# EAGLE design 216_matrix (EAGLE 9.6.2)
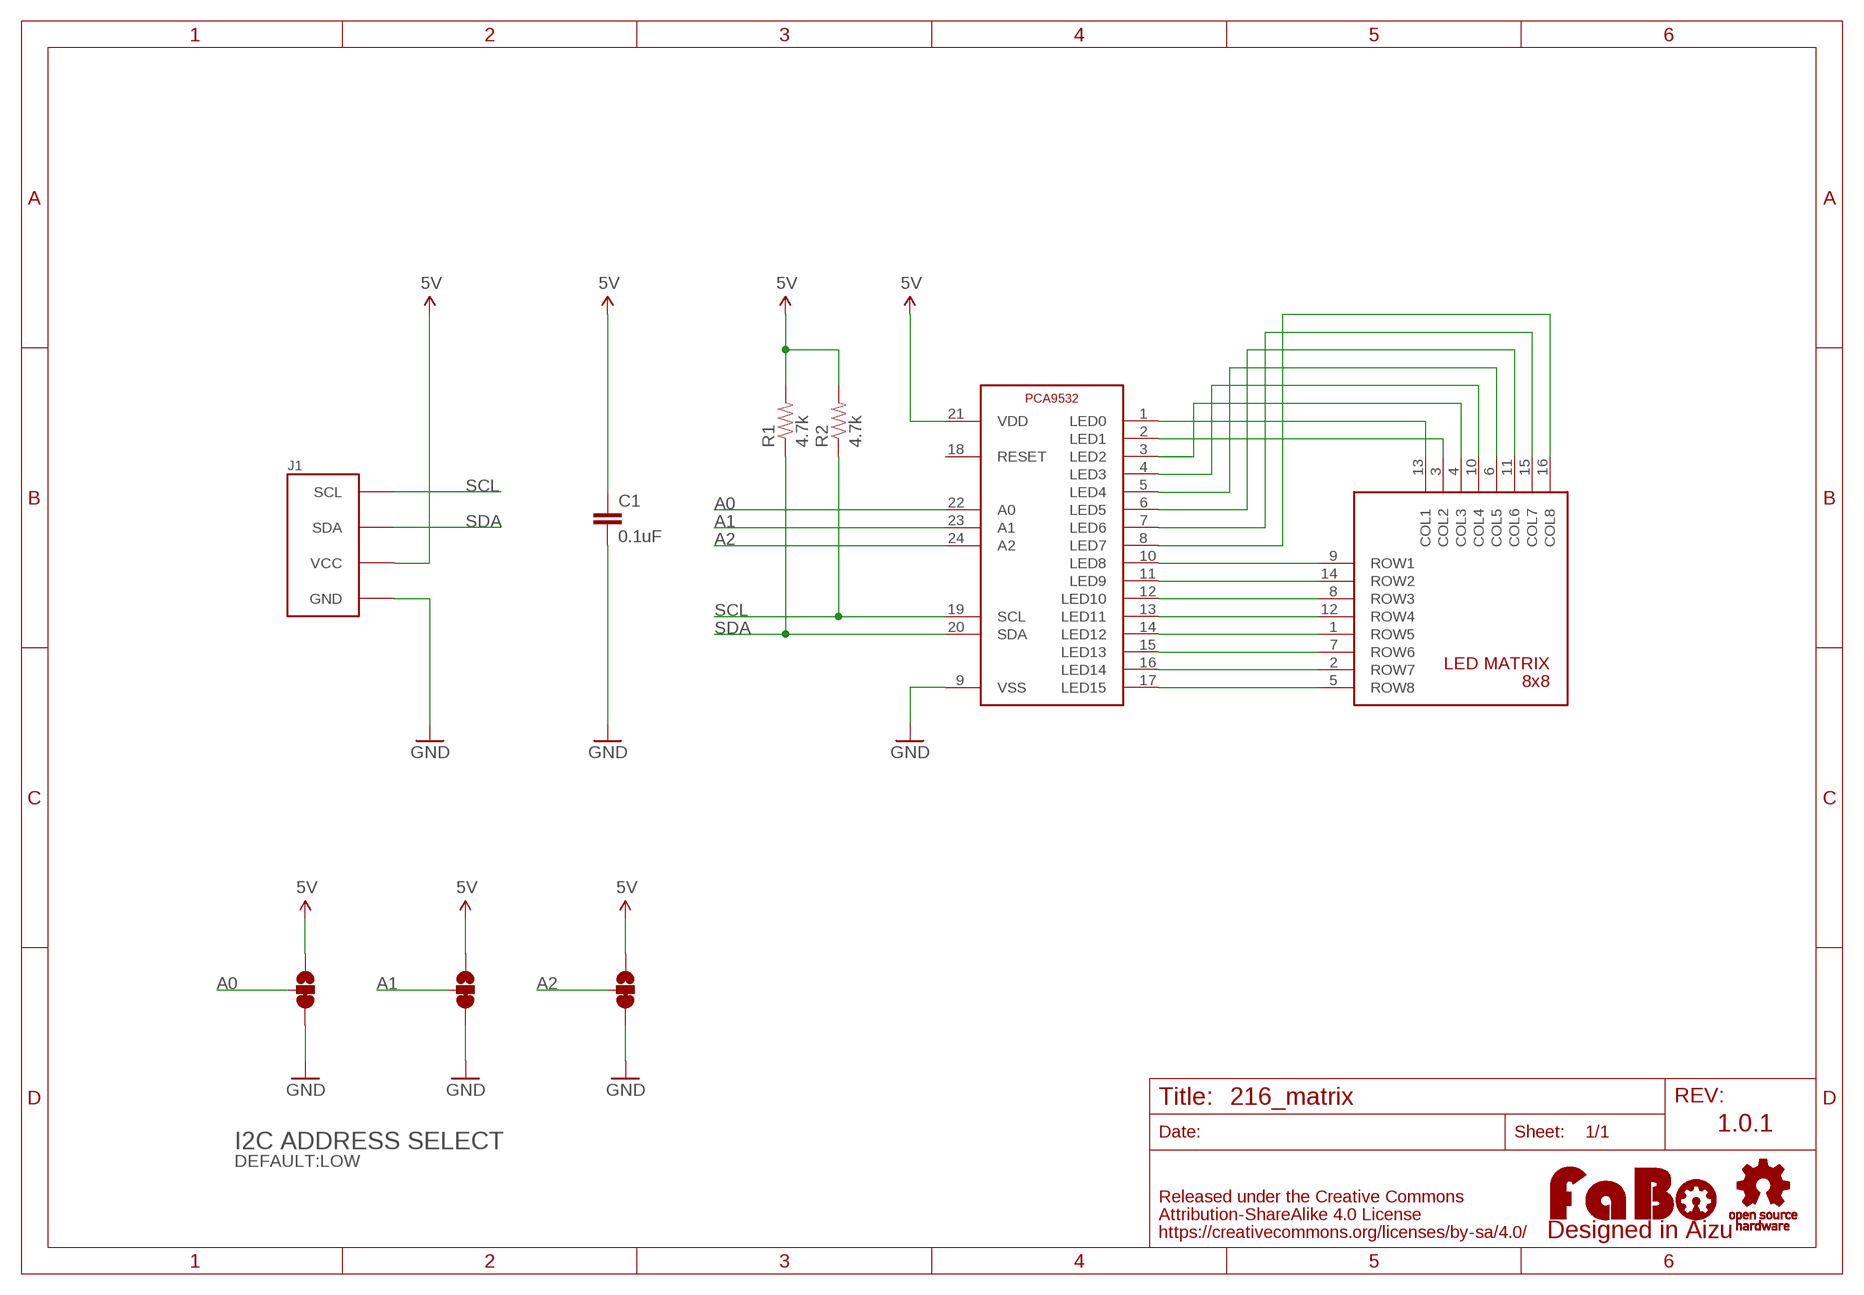
[diagram p0: schematic, sheet 1]

## Parts
A0  JUMPER-3_SMD  [JUMPER-SMD-3]
A1  JUMPER-3_SMD  [JUMPER-SMD-3]
A2  JUMPER-3_SMD  [JUMPER-SMD-3]
C1  0.1uF  CAP-EIA0603  [EIA0603]
IC1  PCA9532BS  [HVQFN24]
J1  FABO_BRICK_I2C  [FABO_BRICK_I2C]
LOGO1  LOGO_FABO-S  [LOGO_FABO_S]
R1  4.7k  RES-EIA0603  [EIA0603]
R2  4.7k  RES-EIA0603  [EIA0603]
U1  MATRIX_8X8_A_COM  [GYXM-788ASR]
U$2  LOGO_OSHW-M_BOTTOM  [LOGO_OSHW_M_BOTTOM]

## Nets
5V: A0.1 A1.1 A2.1 C1.1 IC1.21(VDD) J1.VCC R1.2 R2.2
A0: A0.2 IC1.22(A0)
A1: A1.2 IC1.23(A1)
A2: A2.2 IC1.24(A2)
GND: A0.3 A1.3 A2.3 C1.2 IC1.9(VSS) J1.GND
N$8: IC1.1(LED0) U1.13(COL1)
N$9: IC1.2(LED1) U1.3(COL2)
N$10: IC1.3(LED2) U1.4(COL3)
N$11: IC1.4(LED3) U1.10(COL4)
N$12: IC1.5(LED4) U1.6(COL5)
N$13: IC1.6(LED5) U1.11(COL6)
N$14: IC1.7(LED6) U1.15(COL7)
N$15: IC1.8(LED7) U1.16(COL8)
N$16: IC1.10(LED8) U1.9(ROW1)
N$17: IC1.11(LED9) U1.14(ROW2)
N$18: IC1.12(LED10) U1.8(ROW3)
N$19: IC1.13(LED11) U1.12(ROW4)
N$20: IC1.14(LED12) U1.1(ROW5)
N$21: IC1.15(LED13) U1.7(ROW6)
N$22: IC1.16(LED14) U1.2(ROW7)
N$23: IC1.17(LED15) U1.5(ROW8)
SCL: IC1.19(SCL) J1.SCL R2.1
SDA: IC1.20(SDA) J1.SDA R1.1
Unconnected: IC1.18(RESET)

## Notes on the sheet
- 1.0.1
- I2C ADDRESS SELECT
- DEFAULT:LOW

## Library data of the parts
A0 A1 A2 = component:JUMPER-3
C1 = FaBo-etc:CAP: Capacitor Standard 0603 ceramic capacitor
IC1 = FaBo-etc:PCA9532
J1 = FaBo-Template:FABO_BRICK_I2C: FaBo Brick I2C
LOGO1 = component:LOGO_FABO
R1 R2 = FaBo-etc:RES
U1 = FaBo-LED:MATRIX_8X8_A_COM
U$2 = component:LOGO_OSHW

## Board
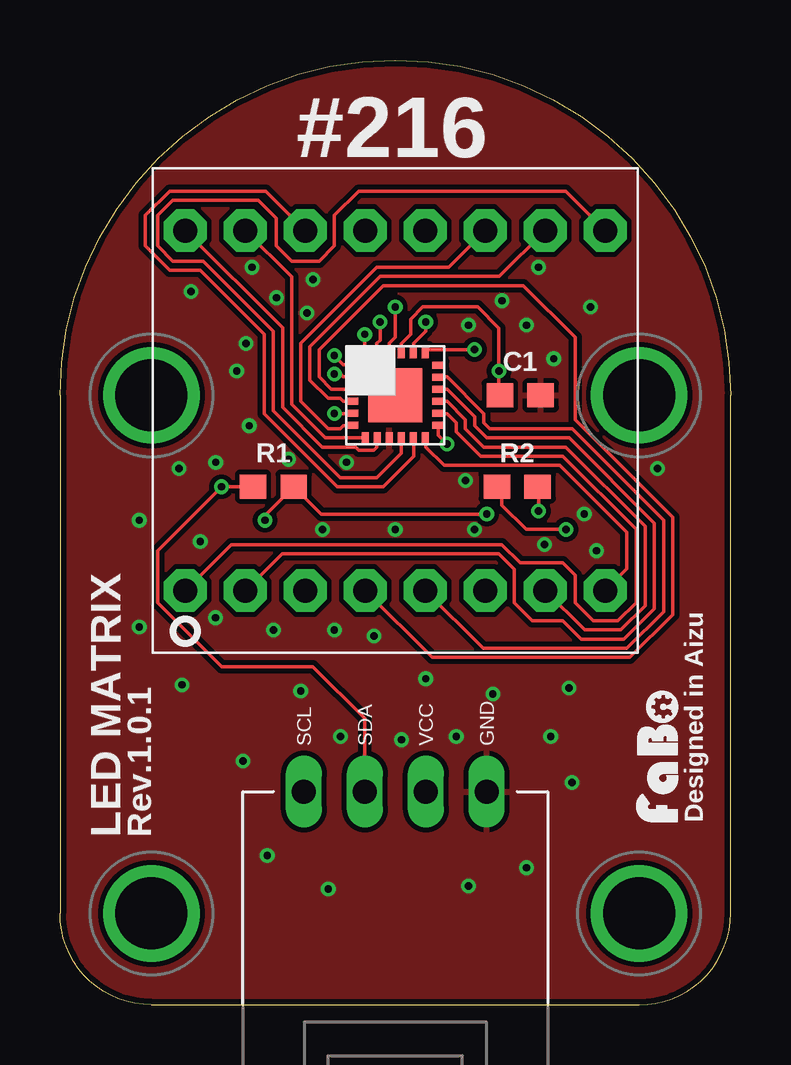
[diagram p1: board, top side]
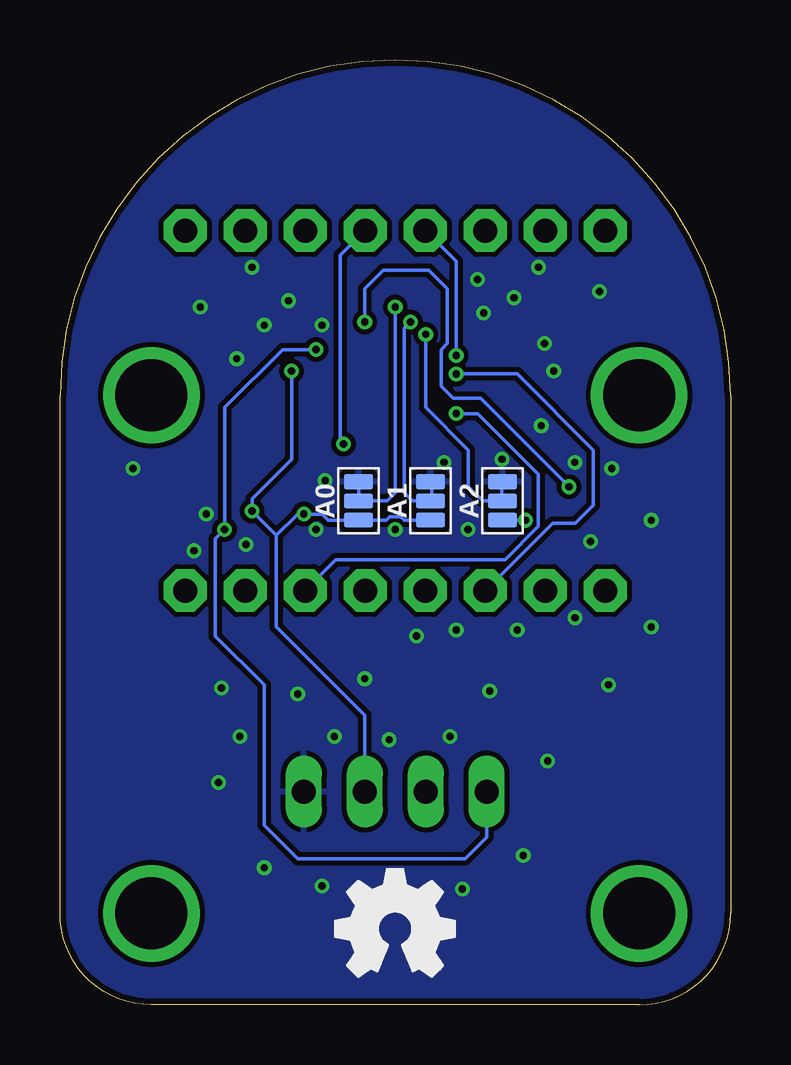
[diagram p2: board, bottom side, seen from below]

Size 27.94 x 39.37 mm. Coordinates in mm from the lower left corner, seen from the top.
Copper layers (1*16): Top 0.035mm / dielectric 1.6mm / Bottom 0.035mm
Design rules "PCBway": minimum track width 6mil, minimum drill 12mil, track to track 6mil, track to pad 6mil, pad to pad 6mil, via to via 6mil, smd to smd 6mil, copper to edge 10mil, drill to drill 10mil, minimum pad ring 10mil, minimum via ring 6mil, stop-mask expansion 2mil, vias tented up to drill 100mil, thermal gap 8mil

### Footprints (pad centres in the part's own frame; a part is rotated, then mirrored left to right if it is on the bottom)
JUMPER-SMD-3 = smd 0.64 x 1.2: 1 -0.8,0; 2 0,0; 3 0.8,0
EIA0603 = smd 1.1 x 1: 1 -0.85,0; 2 0.85,0
HVQFN24 = smd 0.5 x 0.3: 1 -1.8,1.25; 2 -1.8,0.75; 3 -1.8,0.25; 4 -1.8,-0.25; 5 -1.8,-0.75; 6 -1.8,-1.25; 13 1.8,-1.25; 14 1.8,-0.75; 15 1.8,-0.25; 16 1.8,0.25; 17 1.8,0.75; 18 1.8,1.25 | smd 0.3 x 0.5: 7 -1.25,-1.8; 8 -0.75,-1.8; 9 -0.25,-1.8; 10 0.25,-1.8; 11 0.75,-1.8; 12 1.25,-1.8; 19 1.25,1.8; 20 0.75,1.8; 21 0.25,1.8; 22 -0.25,1.8; 23 -0.75,1.8; 24 -1.25,1.8 | smd 2.25 x 2.25: 25 0,0
FABO_BRICK_I2C = drill 1 long: GND 3.81,-10.16; SCL -3.81,-10.16; SDA -1.27,-10.16; VCC 1.27,-10.16 | drill 3 pad 3.81: P$1 -10.16,6.35; P$2 10.16,6.35; P$3 -10.16,-15.24; P$4 10.16,-15.24
GYXM-788ASR = drill 1 pad 1.778 octagon: 1 -8.75,-7.5; 2 -6.25,-7.5; 3 -3.75,-7.5; 4 -1.25,-7.5; 5 1.25,-7.5; 6 3.75,-7.5; 7 6.25,-7.5; 8 8.75,-7.5; 9 8.75,7.5; 10 6.25,7.5; 11 3.75,7.5; 12 1.25,7.5; 13 -1.25,7.5; 14 -3.75,7.5; 15 -6.25,7.5; 16 -8.75,7.5

### Placement (x,y rotation side)
A0  15.5,21 90 bottom
A1  12.5,21 90 bottom
A2  9.5,21 90 bottom
C1  19.18,25.4 0 top
IC1  13.97,25.4 0 top
J1  13.97,19.05 0 top
LOGO1  25.91,10.41 90 top
R1  8.89,21.59 0 top
R2  19.05,21.59 0 top
U1  13.97,24.77 0 top
U$2  13.97,3.17 0 top

### Tracks (layer width: path | path; a pad name or v marks a point on that pad's centre or on a via)
5V  (via drill 0.3)
  Top 0.152: IC1.21 14.22,27.55 14.61,27.94 14.61,28.57 15.11,29.08 17.4,29.08 18.29,28.19 v18.29,26.42 18.29,25.65 | 18.29,25.65 18.33,25.61 C1.1 18.33,25.49 18.29,25.53 18.29,25.65 | R2.2 19.9,21.5 19.94,21.46 v19.94,20.57 | v17.78,20.45 10.88,20.45 R1.2 8.54,20.39 v8.54,20.19
  Bottom 0.152: v18.29,26.42 18.29,22.73 19.94,21.08 v19.94,20.57 18.92,19.56 | J1.VCC 15.24,12.06 18.92,15.75 18.92,19.56 | 18.92,19.56 18.03,20.45 v17.78,20.45 17.02,20.45 16.77,20.2 A0.1 14.34,20.2 14.19,20.34 13.75,20.34 13.6,20.2 A1.1 | A2.1 v8.54,20.19
A0  (via drill 0.3)
  Top 0.152: IC1.22 13.72,27.3 13.72,27.56 13.97,27.81 v13.97,29.08
  Bottom 0.152: A0.2 14.31,21 13.97,21.34 v13.97,29.08
A1  (via drill 0.3)
  Top 0.152: IC1.23 13.21,27.18 13.21,27.56 13.34,27.69 v13.34,28.45
  Bottom 0.152: v13.34,28.45 13.59,28.19 13.59,21.34 13.25,21 A1.2
A2  (via drill 0.3)
  Top 0.152: IC1.24 12.72,27.29 12.7,27.3 v12.7,27.94
  Bottom 0.152: A2.2 10.33,21 10.92,21.59 10.92,23.11 12.7,24.89 v12.7,27.94
GND  (via drill 0.3)
  other vias: 17.02,28.32 19.43,28.32 10.93,19.81 13.97,19.81 11.94,22.61 9.02,29.46 20.19,19.18 22.35,18.92 21.84,20.45 17.27,19.81 7.89,24.13 6.49,22.61 16.89,21.84 9.53,22.73 10.29,28.83 18.41,29.34 19.94,30.73 8,30.73 10.54,30.23 7.75,27.56 5.46,29.72 7.37,26.42 22.1,29.08 20.57,26.92 24.89,22.35 4.95,22.35 5.84,19.3 6.48,16.13 13.08,15.37 8.89,15.62 11.43,15.62 15.24,13.59 18.03,12.95 21.21,13.21 10.03,13.08 5.08,13.34 3.3,15.75 3.3,20.19 11.68,11.18 14.22,11.05 16.51,11.18 20.45,11.18 19.43,5.71 17.02,4.95 11.18,4.83 8.64,6.22 7.62,10.16 21.34,9.27
  pour Top (isolate 0.203): 0,0 27.94,0 27.94,39.37 0,39.37
  pour Bottom (isolate 0.203): 0,0 27.94,0 27.94,39.37 0,39.37
N$1
  Bottom 0.152: 9.53,20.95 9.53,21.72
N$2
  Bottom 0.152: 12.45,20.95 12.45,21.72
N$3
  Bottom 0.152: 15.49,20.95 15.49,21.72
N$8  (via drill 0.3)
  Top 0.152: IC1.1 12.09,26.65 12.06,26.67 11.81,26.67 v11.43,27.05
  Bottom 0.152: U1.13 11.43,30.98 v11.43,27.05
N$9  (via drill 0.3)
  Top 0.152: IC1.2 12.08,26.15 12.06,26.16 11.81,26.16 11.68,26.29 v11.43,26.29
  Bottom 0.152: v11.43,26.29 8.89,26.29 5.71,23.11 5.71,20.83 6.48,20.07 7.42,20.07 U1.3
N$10
  Top 0.152: U1.4 15.51,14.48 23.75,14.48 25.53,16.26 25.53,20.32 21.46,24.38 21.46,27.81 19.3,29.97 13.46,29.97 10.79,27.3 10.79,26.16 11.31,25.65 IC1.3
N$11
  Top 0.152: IC1.4 11.81,25.15 11.68,25.27 11.18,25.27 10.41,26.04 10.41,27.43 13.34,30.35 18.31,30.35 U1.10
  Top 0.203: IC1.4
N$12  (via drill 0.3)
  Top 0.152: IC1.5 12.19,24.64 v11.43,24.64
  Bottom 0.152: v11.43,24.64 10.54,24.64 8.01,22.1 8.01,19.93 9.4,18.54 16.44,18.54 U1.6
N$13
  Top 0.152: 12.15,24.13 11.81,24.13 11.68,24 11.18,24 10.03,25.15 10.03,27.56 13.21,30.73 16.19,30.73 U1.11
  Top 0.203: 12.15,24.13 IC1.6
N$14
  Top 0.152: 12.7,23.62 11.05,23.62 9.65,25.02 9.65,30.33 U1.15
  Top 0.203: 12.7,23.62 IC1.7
N$15
  Top 0.152: 13.21,23.59 13.21,23.24 13.08,23.11 12.45,23.11 12.32,23.24 10.92,23.24 9.27,24.89 9.27,28.21 U1.16
  Top 0.203: 13.21,23.59 IC1.8
N$16
  Top 0.152: IC1.10 14.22,22.99 13.21,21.97 11.68,21.97 8.89,24.77 8.89,28.07 5.97,30.99 4.7,30.99 4.06,31.62 4.06,32.89 4.7,33.53 8.26,33.53 9.02,32.77 9.02,31.62 9.65,30.99 10.79,30.99 11.43,31.62 11.43,32.89 12.45,33.91 21.08,33.91 U1.9
  Top 0.203: IC1.10
N$17
  Top 0.152: 14.73,23.59 14.73,22.86 13.46,21.59 11.56,21.59 8.51,24.64 8.51,27.94 5.84,30.61 4.57,30.61 3.56,31.62 3.56,32.89 4.57,33.91 8.58,33.91 U1.14
  Top 0.203: 14.73,23.59 IC1.11
N$18
  Top 0.152: 15.24,23.58 15.24,23.24 16,22.48 20.83,22.48 23.62,19.68 23.62,18.17 U1.8
  Top 0.203: 15.24,23.58 IC1.12
N$19  (via drill 0.3)
  Top 0.152: IC1.13 15.77,23.73 v16.13,23.37
  Bottom 0.152: U1.12 16.26,31.23 16.26,23.5 v16.13,23.37
N$20
  Top 0.152: 15.78,24.64 16.13,24.64 16.51,24.26 16.51,23.88 17.53,22.86 20.95,22.86 24,19.81 24,16.76 23.24,16 22.23,16 21.46,16.76 21.46,17.91 20.95,18.41 19.18,18.41 18.41,19.18 7.13,19.18 U1.1
  Top 0.203: 15.78,24.64 IC1.14
N$21
  Top 0.152: IC1.15 16.13,25.15 16.89,24.38 16.89,24 17.65,23.24 21.08,23.24 24.38,19.94 24.38,16.64 23.37,15.62 21.86,15.62 U1.7
  Top 0.203: IC1.15
N$22
  Top 0.152: IC1.16 16.13,25.65 17.27,24.51 17.27,24.13 17.78,23.62 21.21,23.62 24.77,20.07 24.77,16.51 23.5,15.24 21.72,15.24 20.95,16 19.68,16 18.92,16.76 18.92,18.16 18.29,18.8 9.25,18.8 U1.2
  Top 0.203: IC1.16
N$23
  Top 0.152: 15.78,26.16 16.13,26.16 17.65,24.64 17.65,24.26 17.91,24 21.34,24 25.15,20.19 25.15,16.38 23.62,14.86 17.63,14.86 U1.5
  Top 0.203: 15.78,26.16 IC1.17
SCL  (via drill 0.3)
  Top 0.152: IC1.19 15.22,27.29 15.24,27.3 v17.27,27.3 | v21.08,19.81 19.43,19.81 18.41,20.83 18.41,21.38 R2.1
  Bottom 0.152: v17.27,27.3 18.67,27.3 21.08,24.89 v21.08,19.81 21.46,19.43 21.46,15.37 19.43,13.34 19.43,7.49 18.03,6.1 11.05,6.1 10.16,6.99 J1.SCL
SDA  (via drill 0.3)
  Top 0.152: IC1.20 14.72,27.29 14.73,27.3 14.73,27.56 15.24,28.07 v15.24,28.45 | R1.1 v6.73,21.59 4.06,18.92 4.06,16.76 6.73,14.1 10.54,14.1 12.7,11.94 J1.SDA
  Bottom 0.152: v6.73,21.59 10.41,25.27 11.56,25.27 12.06,25.78 12.06,27.3 11.81,27.56 11.81,29.84 12.57,30.61 14.48,30.61 15.24,29.84 v15.24,28.45

### Text on the board
tPlace: #216 | Designed in Aizu | LED MATRIX | Rev.1.0.1